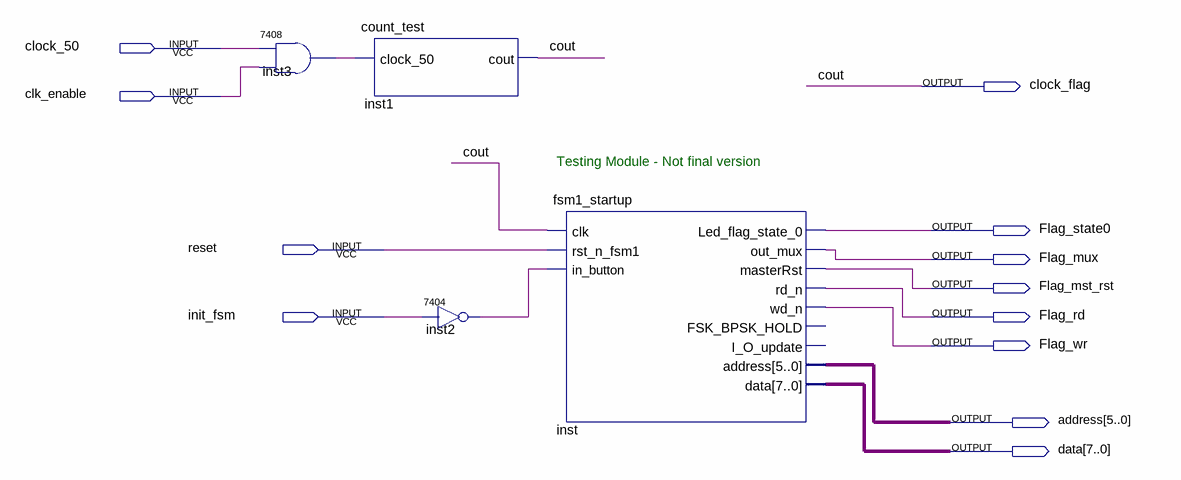
[diagram p0: schematic sheet]
// Quartus schematic fsm1_block.bdf as structural Verilog: 4 symbols, 12 pins
module fsm1_block (
  input  clock_50,
  input  clk_enable,
  input  reset,
  input  init_fsm,
  output clock_flag,
  output Flag_state0,
  output Flag_mux,
  output Flag_mst_rst,
  output Flag_rd,
  output Flag_wr,
  output [5:0] address,
  output [7:0] data
);

  wire inst2_1, inst3_1;

  \7408  inst3 (.\3 (clk_enable), .\2 (clock_50), .\1 (inst3_1));
  count_test inst1 (.clock_50(inst3_1), .cout(clock_flag));
  \7404  inst2 (.\2 (init_fsm), .\1 (inst2_1));
  fsm1_startup inst (
    .clk(clock_flag), .rst_n_fsm1(reset), .in_button(inst2_1), .Led_flag_state_0(Flag_state0),
    .out_mux(Flag_mux), .masterRst(Flag_mst_rst), .rd_n(Flag_rd), .wd_n(Flag_wr), .address(address),
    .data(data));  // open: FSK_BPSK_HOLD, I_O_update

  // Other names for the same wires on the sheet: cout = clock_flag

  // Notes on the sheet:
  //   Testing Module - Not final version
endmodule
